# EAGLE design Half Engine Room (EAGLE 5.10)
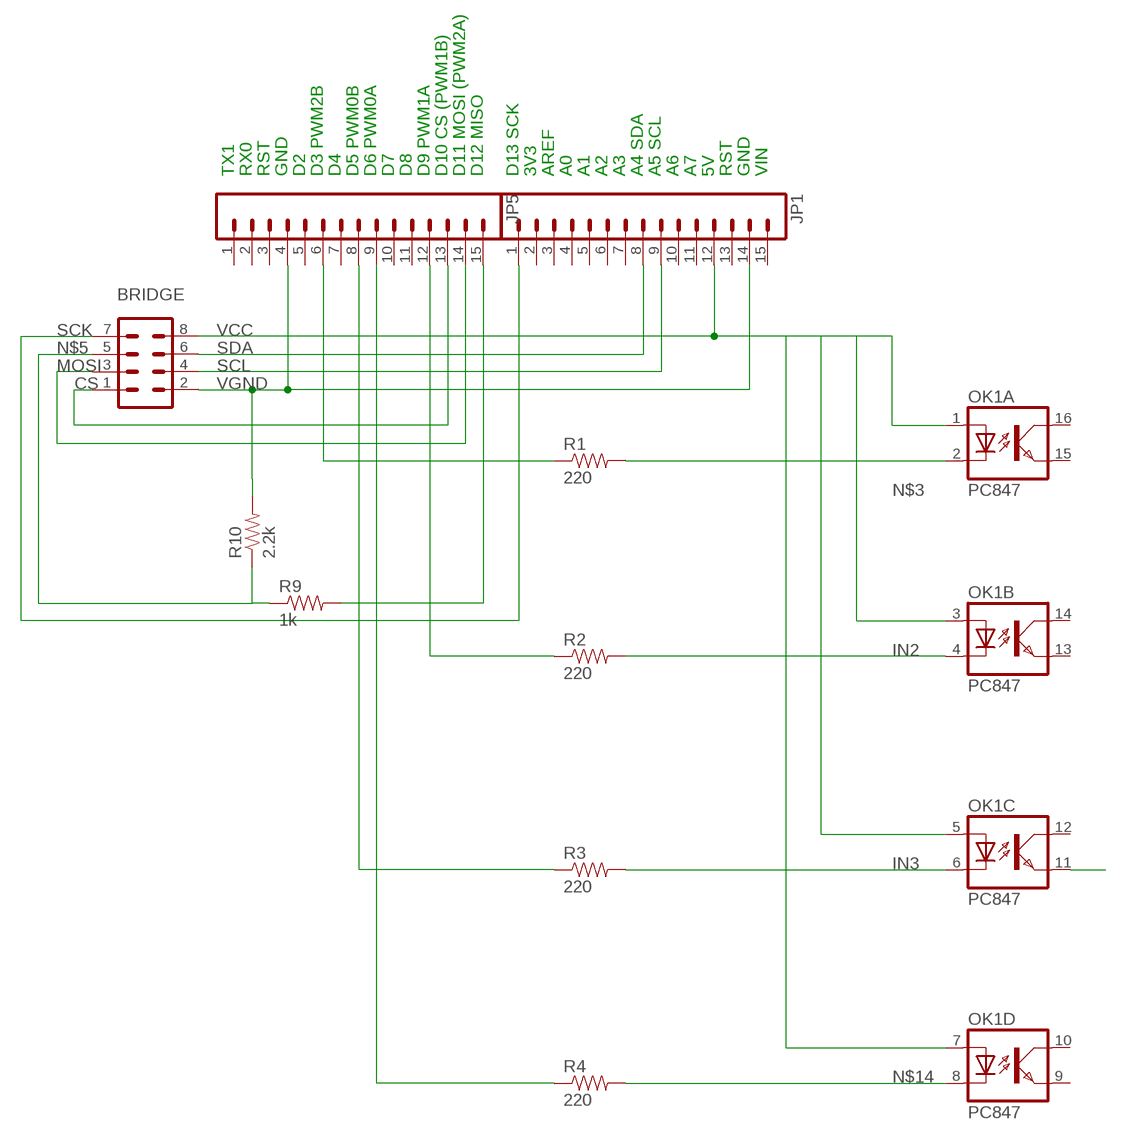
[diagram p0: schematic, sheet 1]

## Parts
BRIDGE  M04X2  [2X4]
JP1  M15  [1X15]
JP5  M15  [1X15]
OK1  PC847  [DIL16]
R1  220  RESISTORPTH1  [AXIAL-0.3]
R2  220  RESISTORPTH1  [AXIAL-0.3]
R3  220  RESISTORPTH1  [AXIAL-0.3]
R4  220  RESISTORPTH1  [AXIAL-0.3]
R9  1k  RESISTORPTH1  [AXIAL-0.3]
R10  2.2k  RESISTORPTH1  [AXIAL-0.3]

## Nets
CS: BRIDGE.1 JP5.13
IN1: JP5.6 R1.P$1
IN2: JP5.12 R2.P$1
IN3: JP5.8 R3.P$1
MISO: JP5.15 R9.P$2
MOSI: BRIDGE.3 JP5.14
N$1: OK1.8(D:C) R4.P$2
N$2: OK1.6(C:C) R3.P$2
N$3: OK1.2(A:C) R1.P$2
N$4: OK1.4(B:C) R2.P$2
N$5: BRIDGE.5 R9.P$1 R10.P$1
N$7 [power]: OK1.11(C:EMIT)
N$14: JP5.9 R4.P$1
SCK: BRIDGE.7 JP1.1
SCL: BRIDGE.4 JP1.9
SDA: BRIDGE.6 JP1.8
VCC: BRIDGE.8 JP1.12 OK1.1(A:A) OK1.3(B:A) OK1.5(C:A) OK1.7(D:A)
VGND: BRIDGE.2 JP1.14 JP5.4 R10.P$2
Unconnected: JP1.2 JP1.3 JP1.4 JP1.5 JP1.6 JP1.7 JP1.10 JP1.11 JP1.13 JP1.15 JP5.1 JP5.2 JP5.3 JP5.5 JP5.7 JP5.10 JP5.11 OK1.9(D:EMIT) OK1.10(D:COL) OK1.12(C:COL) OK1.13(B:EMIT) OK1.14(B:COL) OK1.15(A:EMIT) OK1.16(A:COL)

## Notes on the sheet
- TX1 | RX0 | RST | GND | D2 | D3 PWM2B | D4 | D5 PWM0B | D6 PWM0A | D7 | D8 | D9 PWM1A | D10 CS (PWM1B) | D11 MOSI (PWM2A) | D12 MISO | D13 SCK | 3V3 | AREF | A0 | A1 | A2 | A3 | A4 SDA | A5 SCL | A6 | A7 | 5V | RST | GND | VIN

## Library data of the parts
BRIDGE = SparkFun:M04X2
JP1 JP5 = SparkFun:M15: Header 15 Standard 15-pin 0.1" header. Use with straight break away headers (SKU : PRT-00116), right angle break away headers (PRT-00553), swiss pins (PRT-00743), machine pins (PRT-00117), and female headers (PRT-00115).
OK1 = optocoupler:PC847: SHARP OPTO COUPLER
R1-R4 R9 R10 = SparkFun:RESISTOR: Resistor Basic schematic elements and footprints for 0603, 1206, and PTH 1/10th watt (small) resistors.

## Net classes
1 power: width 1.524 mm, clearance 0.254 mm

## Board
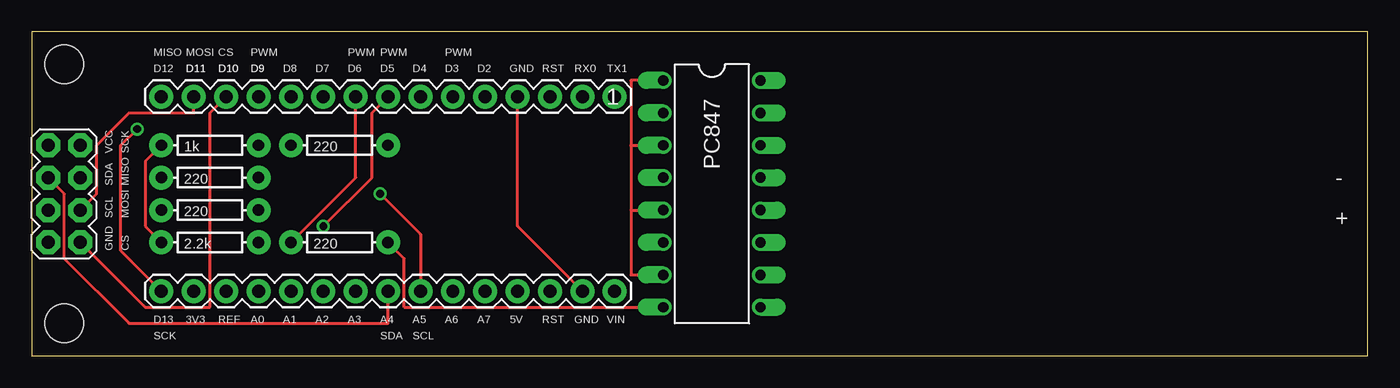
[diagram p1: board, top side]
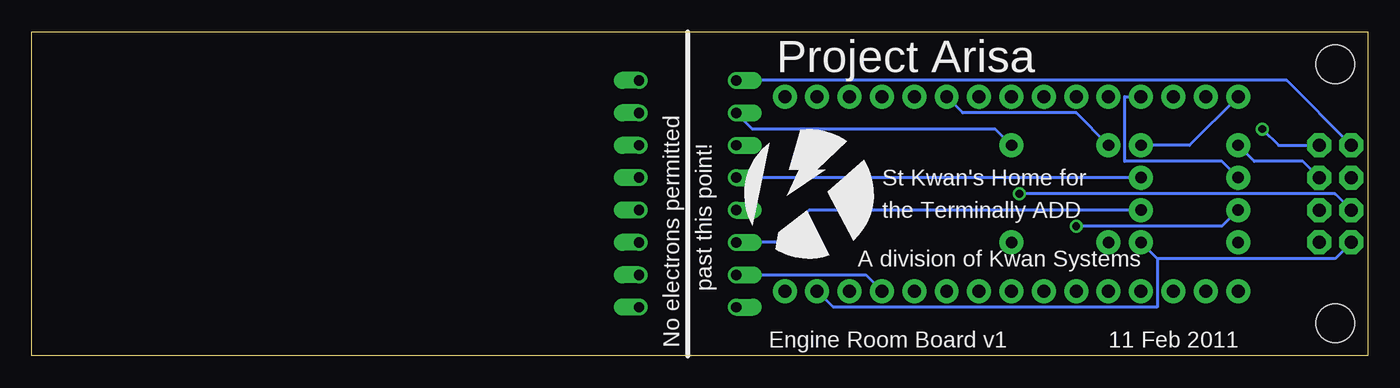
[diagram p2: board, bottom side, seen from below]

Size 104.78 x 25.4 mm. Coordinates in mm from the lower left corner, seen from the top.
Outline: 0,0 104.78,0 104.78,25.4 0,25.4 0,0
Copper layers (1*16): Top 0.035mm / dielectric 1.5mm / Bottom 0.035mm
Design rules "default": minimum track width 10mil, minimum drill 24mil, track to track 8mil, track to pad 8mil, pad to pad 8mil, via to via 8mil, smd to smd 8mil, copper to edge 40mil, drill to drill 8mil, minimum pad ring 10mil, minimum via ring 8mil, stop-mask expansion 4mil, vias tented up to drill 0mil, thermal gap 10mil

### Footprints (pad centres in the part's own frame; a part is rotated, then mirrored left to right if it is on the bottom)
2X4 = drill 1.016 pad 1.88 octagon: 1 -3.81,-1.27; 2 -3.81,1.27; 3 -1.27,-1.27; 4 -1.27,1.27; 5 1.27,-1.27; 6 1.27,1.27; 7 3.81,-1.27; 8 3.81,1.27
1X15 = drill 1.016 pad 1.88 round: 1 0,0; 2 2.54,0; 3 5.08,0; 4 7.62,0; 5 10.16,0; 6 12.7,0; 7 15.24,0; 8 17.78,0; 9 20.32,0; 10 22.86,0; 11 25.4,0; 12 27.94,0; 13 30.48,0; 14 33.02,0; 15 35.56,0
DIL16 = drill 0.813 offset: 1 -8.89,-3.81; 2 -6.35,-3.81; 3 -3.81,-3.81; 4 -1.27,-3.81; 5 1.27,-3.81; 6 3.81,-3.81; 7 6.35,-3.81; 8 8.89,-3.81; 9 8.89,3.81; 10 6.35,3.81; 11 3.81,3.81; 12 1.27,3.81; 13 -1.27,3.81; 14 -3.81,3.81; 15 -6.35,3.81; 16 -8.89,3.81
AXIAL-0.3 = drill 0.9 pad 1.88 round: P$1 -3.81,0; P$2 3.81,0
STAND-OFF-TIGHT = hole 3.048: 0,0

### Placement (x,y rotation side)
BRIDGE  2.54,12.7 90 top
JP1  10.16,5.08 0 top
JP5  45.72,20.32 180 top
OK1  53.34,12.7 270 top
R1  24.13,16.51 0 top
R2  13.97,13.97 0 top
R3  13.97,11.43 0 top
R4  24.13,8.89 0 top
R9  13.97,16.51 0 top
R10  13.97,8.89 0 top
U$1  [STAND-OFF-TIGHT]  2.54,2.54 0 top
U$2  [STAND-OFF-TIGHT]  2.54,22.86 0 top
U$3  [KWAN_CIRCLE]  43.81,12.7 0 bottom

### Tracks (layer width: path | path; a pad name or v marks a point on that pad's centre or on a via)
CS
  Top 0.254: BRIDGE.1 8.89,3.81 13.97,3.81 13.97,19.05 JP5.13
IN1
  Bottom 0.254: R1.P$1 22.86,19.05 31.75,19.05 JP5.6
IN2
  Bottom 0.254: R2.P$1 11.43,15.24 19.05,15.24 19.05,20.32 JP5.12
IN3  (via drill 0.61)
  Top 0.254: v22.86,10.16 26.67,13.97 26.67,19.05 JP5.8
  Bottom 0.254: R3.P$1 11.43,10.16 v22.86,10.16
MISO
  Bottom 0.254: JP5.15 13.97,16.51 R9.P$2
MOSI
  Top 0.254: BRIDGE.3 5.08,12.7 5.08,16.51 7.62,19.05 12.7,19.05 JP5.14
N$1
  Top 0.254: OK1.8 29.21,3.81 29.21,7.62 R4.P$2
N$2
  Bottom 0.254: OK1.6 46.35,8.89 43.81,11.43 R3.P$2
N$3
  Bottom 0.254: OK1.2 48.26,17.78 29.21,17.78 R1.P$2
N$4
  Bottom 0.254: R2.P$2 OK1.4
N$5
  Top 0.254: R10.P$1 8.89,10.16 8.89,15.24 R9.P$1
  Bottom 0.254: BRIDGE.5 5.08,15.24 8.89,15.24 R9.P$1
N$14
  Top 0.254: R4.P$1 25.4,13.97 JP5.9
SCK  (via drill 0.61)
  Top 0.254: JP1.1 6.99,8.26 6.99,16.51 v8.26,17.78
  Bottom 0.254: v8.26,17.78 6.99,16.51 BRIDGE.7
SCL  (via drill 0.61)
  Top 0.254: v27.3,12.7 30.48,9.53 JP1.9
  Bottom 0.254: BRIDGE.4 2.54,12.7 v27.3,12.7
SDA
  Top 0.254: BRIDGE.6 2.54,12.7 2.54,7.62 7.62,2.54 27.94,2.54 JP1.8
VCC
  Top 0.254: OK1.7 46.99,6.35 46.99,11.43 | 46.99,11.43 OK1.5 | 46.99,16.51 OK1.3 | 46.99,16.51 46.99,11.43 | OK1.1 46.99,21.59 46.99,16.51
  Bottom 0.254: BRIDGE.8 6.35,21.59 OK1.1 | JP1.12 39.37,6.35 OK1.7
VGND
  Top 0.254: JP1.14 38.1,10.16 JP5.4
  Bottom 0.254: BRIDGE.2 2.54,7.62 16.51,7.62 | 16.51,7.62 R10.P$2 | 16.51,7.62 16.51,3.81 41.91,3.81 JP1.14

### Text on the board
tPlace: MISO | MOSI | CS | PWM | PWM | PWM | PWM | D12 | D11 | D11 | D10 | D10 | D9 | D9 | D8 | D7 | D6 | D5 | D4 | D3 | D2 | GND | RST | RX0 | TX1 | 1 | VCC | SCK | SDA | MISO | - | SCL | MOSI | + | GND | CS | D13 | 3V3 | REF | A0 | A1 | A2 | A3 | A4 | A5 | A6 | A7 | 5V | RST | GND | VIN | SCK | SDA | SCL
bPlace: Project Arisa | St Kwan's Home for | the Terminally ADD | A division of Kwan Systems | past this point! | 11 Feb 2011 | Engine Room Board v1 | No electrons permitted